# EAGLE design CONTAINER (EAGLE 9.6.2)
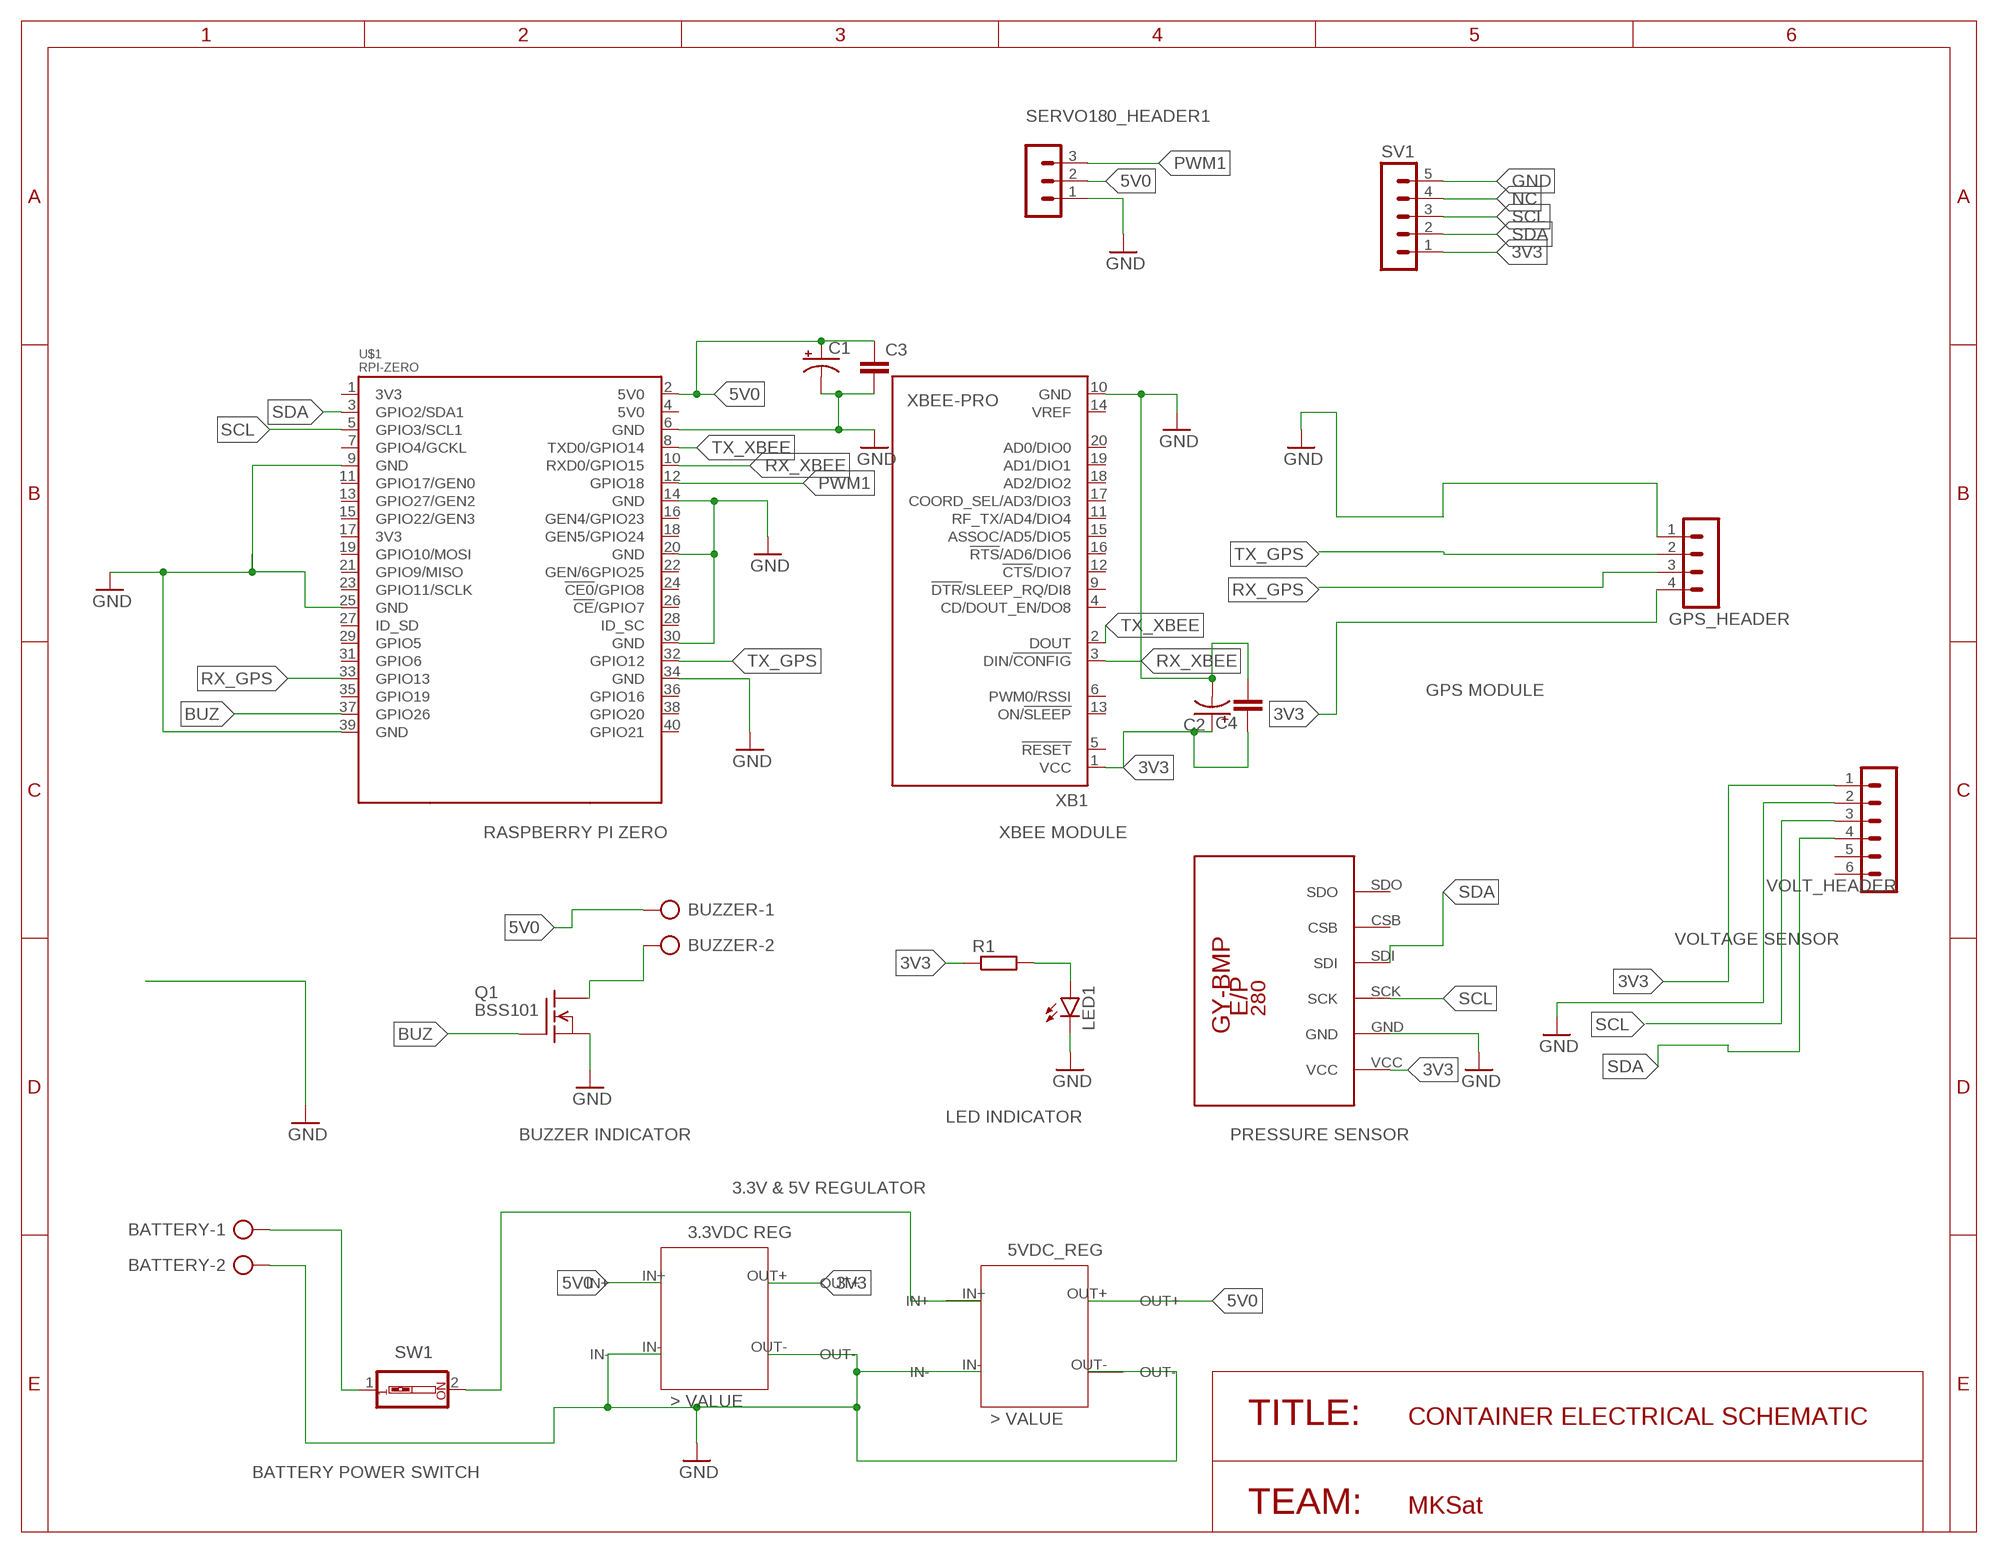
[diagram p0: schematic, sheet 1]

## Parts
BATTERY  AK500/2  [AK500/2]
BUZZER  AK500/2  [AK500/2]
C1  CPOL-USTAP5-45  [TAP5-45]
C2  CPOL-USTAP5-45  [TAP5-45]
C3  C-EU050-030X075  [C050-030X075]
C4  C-EU050-030X075  [C050-030X075]
GPS_HEADER  MA04-1  [MA04-1]
LED1  LED5MM  [LED5MM]
Q1  BSS101  [TO92]
R1  R-EU_0207/12  [0207/12]
SERVO180_HEADER1  MA03-1  [MA03-1]
SV1  MA05-1  [MA05-1]
SW1  SW_DIP-1  [EDG-01]
U$1  RPI-ZERO  [RASPBERRYPI_BASTELSTUBE_V13_RASPI_BOARD_B+_FULL]
U$4  GY-BPM280  [GY-BMP280-FOOTPRINT]
U$5  3VDC_REG  [3VDC_REG]
U$6  5VDC_REG  [5VDC_REG]
VOLT_HEADER  MA06-1  [MA06-1]
XB1  XBEE-PRO  [XBEE-PRO]

## Nets
3V3: C2.+ C4.1 GPS_HEADER.4 R1.1 SV1.1 U$4.VCC U$5.OUT+ VOLT_HEADER.1 XB1.1(VCC)
5V0: BUZZER.1 C1.+ C3.1 SERVO180_HEADER1.2 U$1.2(5V0) U$5.IN+ U$6.OUT+
BUZ: Q1.2(G) U$1.37(GPIO26)
GND: BATTERY.2 C1.- C2.- C3.2 C4.2 GPS_HEADER.1 LED1.K(C) Q1.1(S) SERVO180_HEADER1.1 SV1.5 U$1.6(GND) U$1.9(GND) U$1.14(GND) U$1.20(GND) U$1.25(GND) U$1.30(GND) U$1.34(GND) U$1.39(GND) U$4.GND U$5.IN- U$5.OUT- U$6.IN- U$6.OUT- VOLT_HEADER.2 XB1.10(GND)
N$5: LED1.A R1.2
N$6: BATTERY.1 SW1.1
N$7: SW1.2 U$6.IN+
N$12: BUZZER.2 Q1.3(D)
NC: SV1.4
PWM1: SERVO180_HEADER1.3 U$1.12(GPIO18)
RX_GPS: GPS_HEADER.3 U$1.33(GPIO13)
RX_XBEE: U$1.10(RXD0/GPIO15) XB1.3(DIN/!CONFIG)
SCL: SV1.3 U$1.5(GPIO3/SCL1) U$4.SCK VOLT_HEADER.3
SDA: SV1.2 U$1.3(GPIO2/SDA1) U$4.SDI VOLT_HEADER.4
TX_GPS: GPS_HEADER.2 U$1.32(GPIO12)
TX_XBEE: U$1.8(TXD0/GPIO14) XB1.2(DOUT)
Unconnected: U$1.1(3V3) U$1.4(5V0) U$1.7(GPIO4/GCKL) U$1.11(GPIO17/GEN0) U$1.13(GPIO27/GEN2) U$1.15(GPIO22/GEN3) U$1.16(GEN4/GPIO23) U$1.17(3V3) U$1.18(GEN5/GPIO24) U$1.19(GPIO10/MOSI) U$1.21(GPIO9/MISO) U$1.22(GEN/6GPIO25) U$1.23(GPIO11/SCLK) U$1.24(!CE0!/GPIO8) U$1.26(!CE!/GPIO7) U$1.27(ID_SD) U$1.28(ID_SC) U$1.29(GPIO5) U$1.31(GPIO6) U$1.35(GPIO19) U$1.36(GPIO16) U$1.38(GPIO20) U$1.40(GPIO21) U$4.CSB U$4.SDO VOLT_HEADER.5 VOLT_HEADER.6 XB1.4(CD/DOUT_EN/DO8) XB1.5(!RESET) XB1.6(PWM0/RSSI) XB1.9(!DTR!/SLEEP_RQ/DI8) XB1.11(RF_TX/AD4/DIO4) XB1.12(!CTS!/DIO7) XB1.13(ON/!SLEEP) XB1.14(VREF) XB1.15(ASSOC/AD5/DIO5) XB1.16(!RTS!/AD6/DIO6) XB1.17(COORD_SEL/AD3/DIO3) XB1.18(AD2/DIO2) XB1.19(AD1/DIO1) XB1.20(AD0/DIO0)

## Notes on the sheet
- GPS MODULE
- RASPBERRY PI ZERO | XBEE MODULE
- VOLTAGE SENSOR
- LED INDICATOR
- BUZZER INDICATOR | PRESSURE SENSOR
- 3.3V & 5V REGULATOR
- TITLE: | CONTAINER ELECTRICAL SCHEMATIC
- BATTERY POWER SWITCH
- TEAM: | MKSat

## Library data of the parts
BATTERY BUZZER = con-ptr500:AK500/2: CONNECTOR; OC_FARNELL: unknown; OC_NEWARK: unknown
C1 C2 = rcl:CPOL-US: POLARIZED CAPACITOR, American symbol; SPICEPREFIX: C
C3 C4 = rcl:C-EU: CAPACITOR, European symbol; SPICEPREFIX: C
GPS_HEADER = con-lstb:MA04-1: PIN HEADER; OC_FARNELL: unknown; OC_NEWARK: unknown
LED1 = led:LED: LED OSRAM: - CHIPLED LG R971, LG N971, LY N971, LG Q971, LY Q971, LO R971, LY R971 LH N974, LH R974 LS Q976, LO Q976, LY Q976 LO Q996 - Hyper CHIPLED LW Q18S LB Q993, LB Q99A, LB R99A - SideLED LS A670, LO A670, LY A670, LG A670, LP A670 LB A673, LV A673, LT A673, LW A673 LH A674 LY A675 LS A676, LA A676, LO A676, LY A676, LW A676 LS A679, LY A679, LG A679 - Hyper Micro SIDELED® LS Y876, LA Y876, LO Y876, LY Y876 LT Y87S - SmartLED LW L88C, LW L88S LB L89C, LB L89S, LG L890 LS L89K, LO L89K, LY L89K LS L896, LA L896, LO L896, LY L896 - TOPLED LS T670, LO T670, LY T670, LG T670, LP T670 LSG T670, LSP T670, LSY T670, LOP T670, LYG T670 LG T671, LOG T671, LSG T671 LB T673, LV T673, LT T673, LW T673 LH T674 LS T676, LA T676, LO T676, LY T676, LB T676, LH T676, LSB T676, LW T676 LB T67C, LV T67C, LT T67C, LS T67K, LO T67K, LY T67K, LW E67C LS E67B, LA E67B, LO E67B, LY E67B, LB E67C, LV E67C, LT E67C LW T67C LS T679, LY T679, LG T679 LS T770, LO T770, LY T770, LG T770, LP T770 LB T773, LV T773, LT T773, LW T773 LH T774 LS E675, LA E675, LY E675, LS T675 LS T776, LA T776, LO T776, LY T776, LB T776 LHGB T686 LT T68C, LB T68C - Hyper Mini TOPLED® LB M676 - Mini TOPLED Santana® LG M470 LS M47K, LO M47K, LY M47K Source: http://www.osram.convergy.de LUXEON: - LUMILED® LXK2-PW12-R00, LXK2-PW12-S00, LXK2-PW14-U00, LXK2-PW14-V00 LXK2-PM12-R00, LXK2-PM12-S00, LXK2-PM14-U00 LXK2-PE12-Q00, LXK2-PE12-R00, LXK2-PE12-S00, LXK2-PE14-T00, LXK2-PE14-U00 LXK2-PB12-K00, LXK2-PB12-L00, LXK2-PB12-M00, LXK2-PB14-N00, LXK2-PB14-P00, LXK2-PB14-Q00 LXK2-PR12-L00, LXK2-PR12-M00, LXK2-PR14-Q00, LXK2-PR14-R00 LXK2-PD12-Q00, LXK2-PD12-R00, LXK2-PD12-S00 LXK2-PH12-R00, LXK2-PH12-S00 LXK2-PL12-P00, LXK2-PL12-Q00, LXK2-PL12-R00 Source: www.luxeon.com KINGBRIGHT: KA-3528ASYC Source: www.kingbright.com
Q1 = transistor-fet:BSS101: N-Channel Enhancement MOSFET 200V; 0,16A; 11Ohm
R1 = rcl:R-EU_: RESISTOR, European symbol; SPICEPREFIX: R
SERVO180_HEADER1 = con-lstb:MA03-1: PIN HEADER; OC_FARNELL: unknown; OC_NEWARK: unknown
SV1 = con-lstb:MA05-1: PIN HEADER; OC_FARNELL: unknown; OC_NEWARK: unknown
SW1 = special:SW_DIP-1: DIP SWITCH
U$1 = RPI-Zero:RPI-ZERO
U$4 = GY-BMP280:GY-BPM280
U$5 = VOLTAGE_REGULATORS_CANSAT:3VDC_REG
U$6 = VOLTAGE_REGULATORS_CANSAT:5VDC_REG
VOLT_HEADER = con-lstb:MA06-1: PIN HEADER; OC_FARNELL: unknown; OC_NEWARK: unknown
XB1 = maxstream:XBEE: XBee (TM) /XBee-PRO(TM) OEM RF Modules Source: MaxStream, Inc. xbee_productmanual.pdf; MPN: XBP24-AWI-001; OC_FARNELL: 1337916; OC_NEWARK: 42M2667

## Board
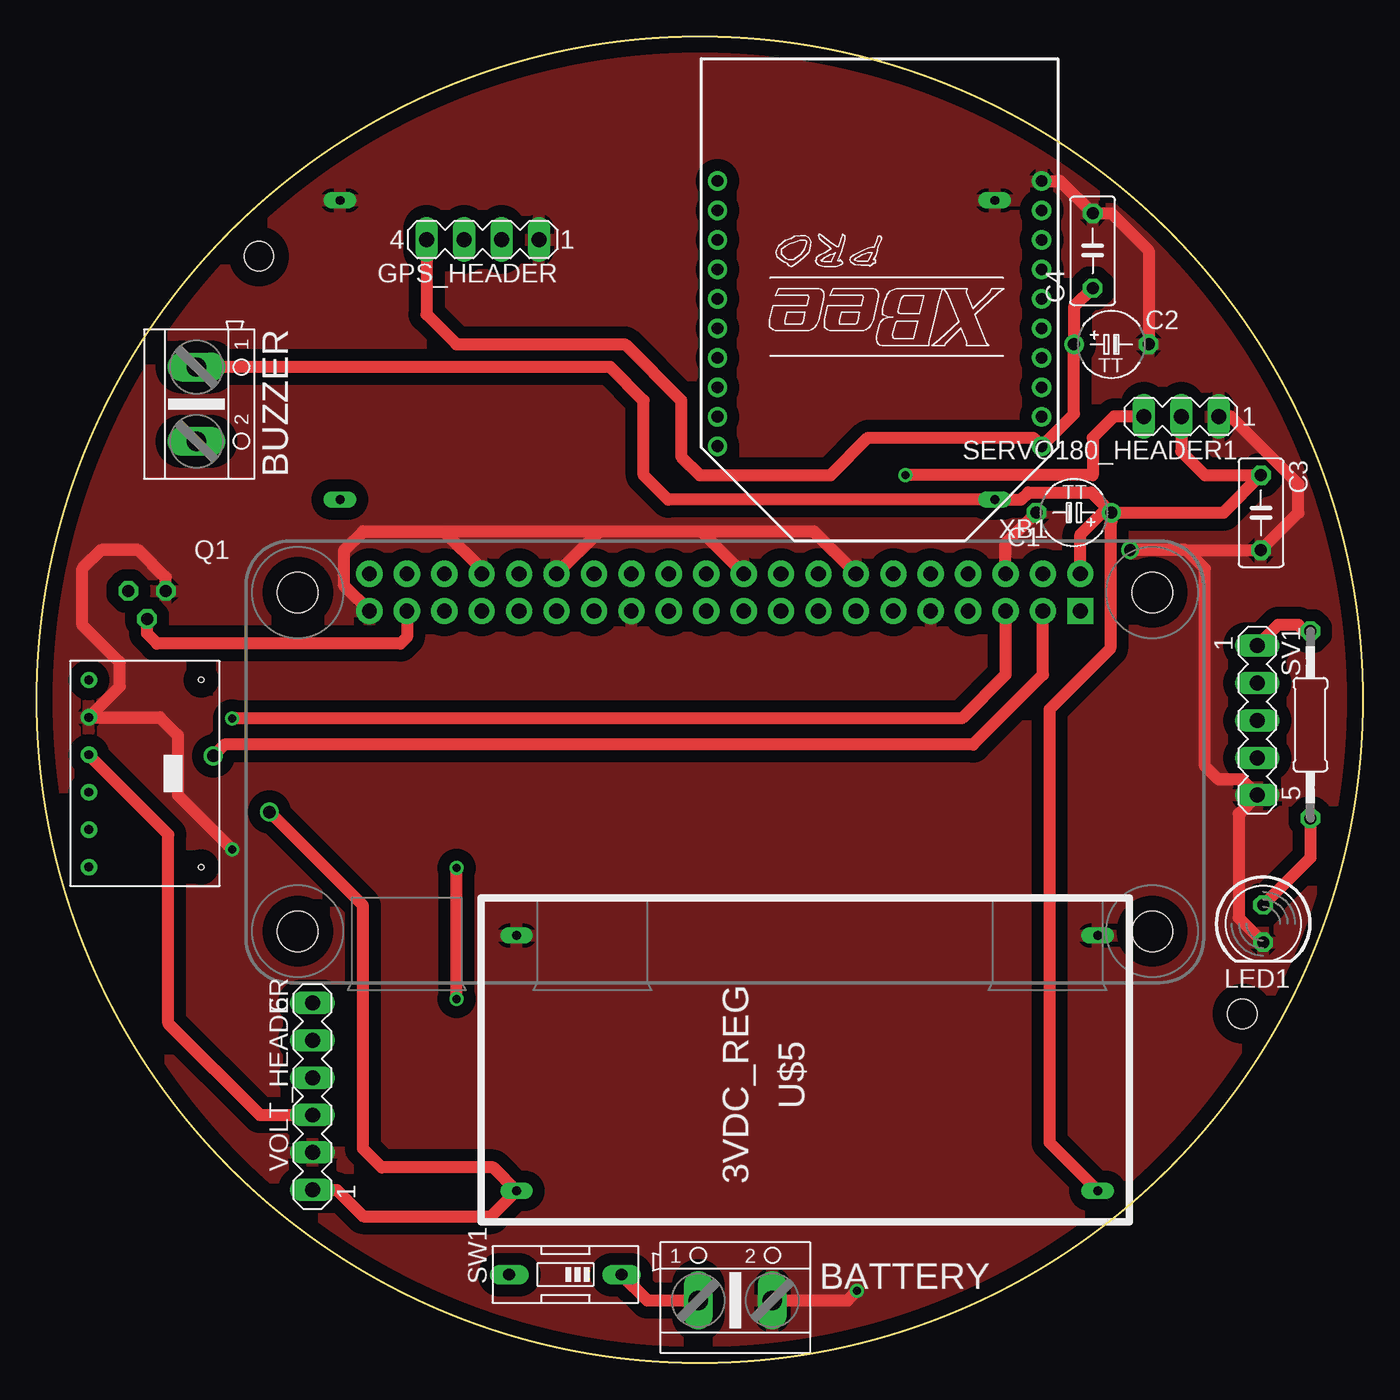
[diagram p1: board, top side]
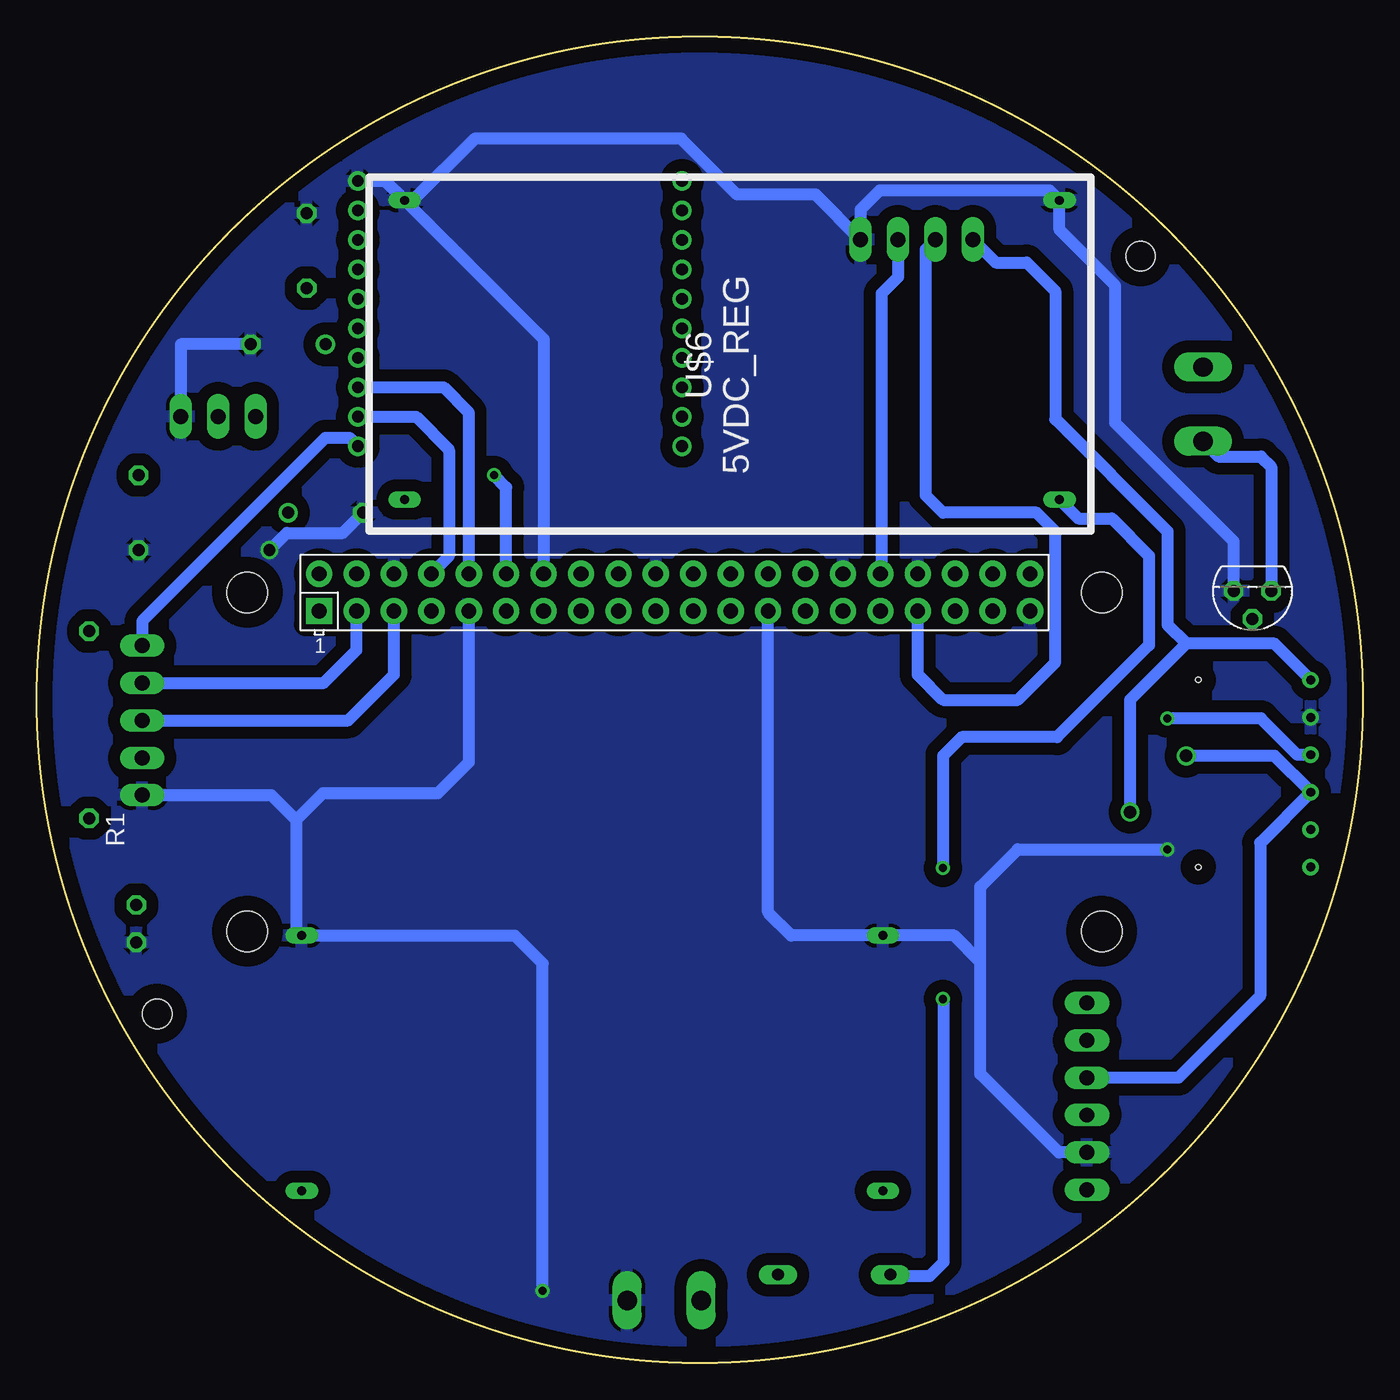
[diagram p2: board, bottom side, seen from below]

Size 90 x 90 mm. Coordinates in mm from the lower left corner, seen from the top.
Outline: circle at 45,45 radius 45
Copper layers (1*16): Top 0.035mm / dielectric 1.5mm / Bottom 0.035mm
Design rules "default *": minimum track width 6mil, minimum drill 0.35mm, track to track 12mil, track to pad 12mil, pad to pad 12mil, via to via 12mil, smd to smd 12mil, copper to edge 40mil, drill to drill 6mil, minimum pad ring 10mil, minimum via ring 8mil, stop-mask expansion 4mil, vias tented up to drill 0mil, thermal gap 10mil
Holes 2 mm at 15.08,75.1 81.84,23.69

### Footprints (pad centres in the part's own frame; a part is rotated, then mirrored left to right if it is on the bottom)
AK500/2 = drill 1.321 long: 1 -2.515,0; 2 2.515,0
TAP5-45 = drill 0.813: + -2.54,0 | drill 0.813 octagon: - 2.54,0
C050-030X075 = drill 0.813 octagon: 1 -2.54,0; 2 2.54,0
MA04-1 = drill 1.016 long: 1 -3.81,0; 2 -1.27,0; 3 1.27,0; 4 3.81,0
LED5MM = drill 0.813 octagon: A -1.27,0; K 1.27,0
TO92 = drill 0.813 octagon: 1 1.27,0; 2 0,1.905; 3 -1.27,0
0207/12 = drill 0.813 octagon: 1 -6.35,0; 2 6.35,0
MA03-1 = drill 1.016 long: 1 -2.54,0; 2 0,0; 3 2.54,0
MA05-1 = drill 1.016 long: 1 -5.08,0; 2 -2.54,0; 3 0,0; 4 2.54,0; 5 5.08,0
EDG-01 = drill 0.813 long: 1 0,-3.81; 2 0,3.81
RASPBERRYPI_BASTELSTUBE_V13_RASPI_BOARD_B+_FULL = drill 1 pad 1.778 square: 1 8.37,25.23 | drill 1 pad 1.778: 2 8.37,27.77; 3 10.91,25.23; 4 10.91,27.77; 5 13.45,25.23; 6 13.45,27.77; 7 15.99,25.23; 8 15.99,27.77; 9 18.53,25.23; 10 18.53,27.77; 11 21.07,25.23; 12 21.07,27.77; 13 23.61,25.23; 14 23.61,27.77; 15 26.15,25.23; 16 26.15,27.77; 17 28.69,25.23; 18 28.69,27.77; 19 31.23,25.23; 20 31.23,27.77; 21 33.77,25.23; 22 33.77,27.77; 23 36.31,25.23; 24 36.31,27.77; 25 38.85,25.23; 26 38.85,27.77; 27 41.39,25.23; 28 41.39,27.77; 29 43.93,25.23; 30 43.93,27.77; 31 46.47,25.23; 32 46.47,27.77; 33 49.01,25.23; 34 49.01,27.77; 35 51.55,25.23; 36 51.55,27.77; 37 54.09,25.23; 38 54.09,27.77; 39 56.63,25.23; 40 56.63,27.77 | hole 2.75: 3.5,3.5; 3.5,26.5; 61.5,3.5; 61.5,26.5
GY-BMP280-FOOTPRINT = drill 0.6: CSB 11.43,0; GND 3.81,0; SCK 6.35,0; SDI 8.89,0; SDO 13.97,0; VCC 1.27,0 | hole 0.35: 1.27,7.62; 13.97,7.62
3VDC_REG = drill 0.6 long: IN+ -17.86,8.89; IN- -17.86,-8.43; OUT+ 21.59,8.89; OUT- 21.59,-8.43
5VDC_REG = drill 0.6 long: IN+ -22.86,8.89; IN- -22.86,-11.43; OUT+ 21.59,8.89; OUT- 21.59,-11.43
MA06-1 = drill 1.016 long: 1 -6.35,0; 2 -3.81,0; 3 -1.27,0; 4 1.27,0; 5 3.81,0; 6 6.35,0
XBEE-PRO = drill 0.8 pad 1.27: 1 -11,9; 2 -11,7; 3 -11,5; 4 -11,3; 5 -11,1; 6 -11,-1; 7 -11,-3; 8 -11,-5; 9 -11,-7; 10 -11,-9; 11 11,-9; 12 11,-7; 13 11,-5; 14 11,-3; 15 11,-1; 16 11,1; 17 11,3; 18 11,5; 19 11,7; 20 11,9

### Placement (x,y rotation side)
BATTERY  47.41,4.23 0 top
BUZZER  10.84,65.07 270 top
C1  70.4,57.7 180 top
C2  72.94,69.13 0 top
C3  83.1,57.7 270 top
C4  71.67,75.48 90 top
GPS_HEADER  30.27,76.24 180 top
LED1  83.25,29.8 270 top
Q1  7.48,52.39 180 bottom
R1  86.45,43.31 270 top
SERVO180_HEADER1  77.68,64.23 180 top
SV1  82.85,43.6 270 top
SW1  35.88,5.98 90 top
U$1  79.21,25.79 0 bottom
U$4  3.53,47.62 270 top
U$5  54.16,20.56 180 top
U$6  43.44,67.47 180 bottom
VOLT_HEADER  18.71,18.08 90 top
XB1  57.21,71.21 180 top

### Tracks (layer width: path | path; a pad name or v marks a point on that pad's centre or on a via)
3V3  (via drill 0.85)
  Top 0.813: C4.1 70.4,71.67 C2.+ 70.4,64.4 XB1.1 67.64,62.78 56.43,62.78 53.89,60.24 45,60.24 43.73,61.51 43.73,65.32 39.92,69.13 28.49,69.13 26.46,71.16 GPS_HEADER.4 | VOLT_HEADER.1 20.36,11.73 22.14,9.95 30.84,9.95 U$5.OUT+ 30.99,13.25 23.41,13.25 22.14,14.52 22.14,31.03 v15.79,37.38 | R1.1 86.06,49.66 85.64,50.08 84.24,50.08 SV1.1
  Bottom 0.813: SV1.1 82.85,50.33 70.4,62.78 68.78,62.78 XB1.1 | 11.98,48.81 13.25,50.08 13.25,56.43 20.87,64.05 20.87,72.75 22.8,74.69 24.9,74.69 GPS_HEADER.4 | U$4.VCC 6,48.81 11.98,48.81 | 11.98,48.81 15.79,45 v15.79,37.38
5V0
  Top 0.813: BUZZER.1 38.93,67.58 41.19,65.32 41.19,60.24 42.85,58.58 U$6.OUT+ 66.8,58.58 67.29,59.07 71.57,59.07 C1.+ | U$1.2 70.84,56.22 72.32,57.7 C1.+ | U$5.IN+ 68.75,14.94 68.75,44.35 72.87,48.48 72.87,56.95 72.94,57.02 C1.+ | SERVO180_HEADER1.2 77.68,61.85 79.29,60.24 C3.1 80.56,57.7 C1.+
BUZ
  Top 0.813: U$1.37 25.12,49.25 24.68,48.81 8.17,48.81 7.48,49.5 Q1.2
GND  (via drill 0.55 pad 0.8, 0.8 pad 0.55)
  Top 0.813: v55.67,4.87 55.03,4.23 BATTERY.2 | 78.02,55.16 79.29,53.89 79.29,40.5 80.2,39.59 81.78,39.59 SV1.5 81.58,37.25 81.58,30.2 LED1.K | Q1.1 8.75,53.31 6.9,55.16 4.36,55.16 3.09,53.89 3.09,50.08 5.63,47.54 5.63,45.9 U$4.GND 8.35,43.8 9.57,42.59 9.57,38.52 v13.25,34.84 | U$1.14 52.73,56.43 45.1,56.43 | 45.1,56.43 U$1.20 | U$1.39 20.87,52.73 20.87,55.16 22.14,56.43 27.66,56.43 | 27.66,56.43 30.2,53.89 U$1.34 | 45.1,56.43 38.15,56.43 | 38.15,56.43 27.66,56.43 | U$1.30 38.15,56.43 | U$1.6 65.76,55.6 C1.- | 78.02,55.16 v74.21,55.16 | 78.02,55.16 C3.2 85.64,57.7 85.64,59.64 81.05,64.23 SERVO180_HEADER1.1 | XB1.10 69.48,80.21 C4.2 72.94,78.02 75.48,75.48 C2.-
  Bottom 0.813: v55.67,4.87 55.67,27.09 57.57,28.99 U$5.IN- 72.4,29.38 72.4,36.84 | U$6.OUT- 66.34,80.21 XB1.10 | Q1.1 8.75,55.74 16.79,63.78 16.79,73.11 20.58,76.9 U$6.IN- 21.24,79.56 32.79,79.56 34.08,78.27 GPS_HEADER.1 37.13,79.29 42.46,79.29 46.27,83.1 60.24,83.1 64.44,78.9 U$6.OUT- | 25.95,27.22 25.95,19.6 20.62,14.27 VOLT_HEADER.2 | 25.95,27.22 27.72,28.99 U$5.OUT- 38.79,28.99 40.36,30.56 U$1.25 | SV1.5 74.08,38.52 72.4,36.84 | v13.25,34.84 23.41,34.84 25.95,32.3 25.95,27.22 | U$1.9 60.68,40.75 62.78,38.65 70.58,38.65 72.4,36.84 | U$6.OUT- 55.6,69.47 U$1.14 | v74.21,55.16 73.04,56.33 69.23,56.33 C1.- | SERVO180_HEADER1.1 80.22,69.13 C2.-
  pour Top (isolate 0.813): -5.8,105.96 93.26,105.96 93.26,-5.8 -5.8,-5.8
  pour Bottom (isolate 0.813): -5.8,105.96 93.26,105.96 93.26,-5.8 -5.8,-5.8
N$5
  Top 0.813: R1.2 86.45,34.28 LED1.A
N$6
  Top 0.813: SW1.1 41.44,4.23 BATTERY.1
N$7  (via drill 0.55 pad 0.8)
  Top 0.813: v28.49,24.68 v28.49,33.57
  Bottom 0.813: U$6.IN+ 19.31,57.31 17.04,57.31 14.5,54.77 14.5,48.7 20.74,42.46 27.22,42.46 28.49,41.19 v28.49,33.57 | SW1.2 31.97,5.88 29.38,5.88 28.43,6.84 28.43,24.62 v28.49,24.68
N$12
  Bottom 0.813: BUZZER.2 9.8,61.51 6.9,61.51 6.21,60.82 Q1.3
PWM1  (via drill 0.55 pad 0.8)
  Top 0.813: v58.97,60.24 71.67,60.24 71.67,62.78 73.12,64.23 SERVO180_HEADER1.3
  Bottom 0.813: U$1.12 58.14,59.41 v58.97,60.24
RX_GPS
  Bottom 0.813: U$1.33 30.2,46.71 28.49,45 23.41,45 20.87,47.54 20.87,56.43 22.14,57.7 28.49,57.7 29.66,58.87 29.66,75.58 GPS_HEADER.3
RX_XBEE
  Bottom 0.813: XB1.3 62.4,66.21 60.68,64.49 U$1.10
SCL  (via drill 0.55 pad 0.8)
  Top 0.813: v13.25,43.73 62.78,43.73 65.76,46.71 U$1.5 | U$4.SCK 3.53,41.26 8.93,35.86 8.93,23.03 15.16,16.81 VOLT_HEADER.3
  Bottom 0.813: SV1.3 68.86,43.6 65.76,46.71 U$1.5 | U$4.SCK 4.44,41.27 6.9,43.73 v13.25,43.73
SDA  (via drill 0.85)
  Top 0.813: U$1.3 68.3,46.71 63.54,41.95 12.74,41.95 v11.98,41.19
  Bottom 0.813: SV1.2 70.53,46.14 68.3,48.37 U$1.3 | VOLT_HEADER.4 12.5,19.35 6.96,24.88 6.96,35.3 U$4.SDI 6,41.19 v11.98,41.19
TX_GPS
  Bottom 0.813: U$1.32 32.66,53.64 32.66,72.58 31.54,73.7 GPS_HEADER.2
TX_XBEE
  Bottom 0.813: XB1.2 64.27,64.21 62.02,61.96 62.02,54.76 U$1.8

### Text on the board
Text: BMP-280